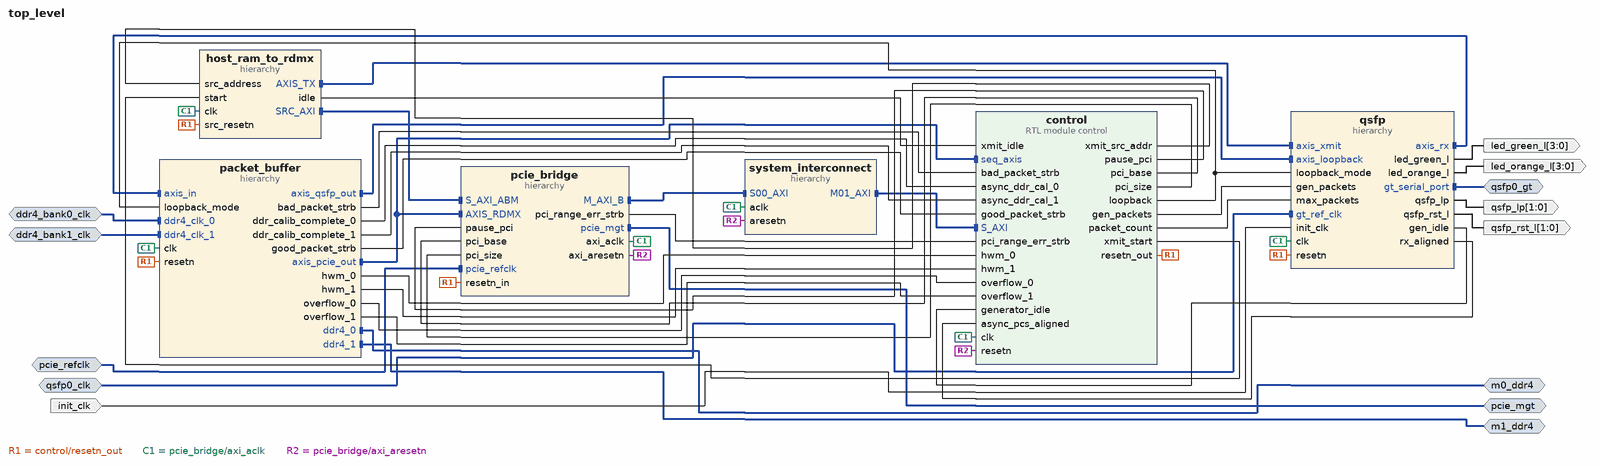
[diagram p0: block diagram of the top level]
# Vivado block design top_level, xcvu3p-ffvc1517-2-e, Vivado 2021.1
create_bd_design top_level

create_bd_intf_port -mode Slave -vlnv xilinx.com:interface:diff_clock_rtl:1.0 pcie_refclk
create_bd_intf_port -mode Master -vlnv xilinx.com:interface:pcie_7x_mgt_rtl:1.0 pcie_mgt
create_bd_intf_port -mode Slave -vlnv xilinx.com:interface:diff_clock_rtl:1.0 ddr4_bank0_clk
create_bd_intf_port -mode Master -vlnv xilinx.com:interface:ddr4_rtl:1.0 m0_ddr4
create_bd_intf_port -mode Master -vlnv xilinx.com:interface:ddr4_rtl:1.0 m1_ddr4
create_bd_intf_port -mode Slave -vlnv xilinx.com:interface:diff_clock_rtl:1.0 ddr4_bank1_clk
create_bd_intf_port -mode Slave -vlnv xilinx.com:interface:diff_clock_rtl:1.0 qsfp0_clk
set_property -dict {CONFIG.FREQ_HZ 322265625} [get_bd_intf_ports qsfp0_clk]
create_bd_intf_port -mode Master -vlnv xilinx.com:interface:gt_rtl:1.0 qsfp0_gt
create_bd_port -dir I init_clk
create_bd_port -dir O -from 1 -to 0 qsfp_lp
create_bd_port -dir O -from 1 -to 0 qsfp_rst_l
create_bd_port -dir O -from 3 -to 0 led_green_l
create_bd_port -dir O -from 3 -to 0 led_orange_l

create_bd_cell -type hier pcie_bridge
create_bd_cell -type hier packet_buffer
create_bd_cell -type hier qsfp
create_bd_cell -type hier system_interconnect
create_bd_cell -type hier host_ram_to_rdmx
create_bd_cell -type module -reference control control

# ---- hierarchy /pcie_bridge ----
current_bd_instance /pcie_bridge
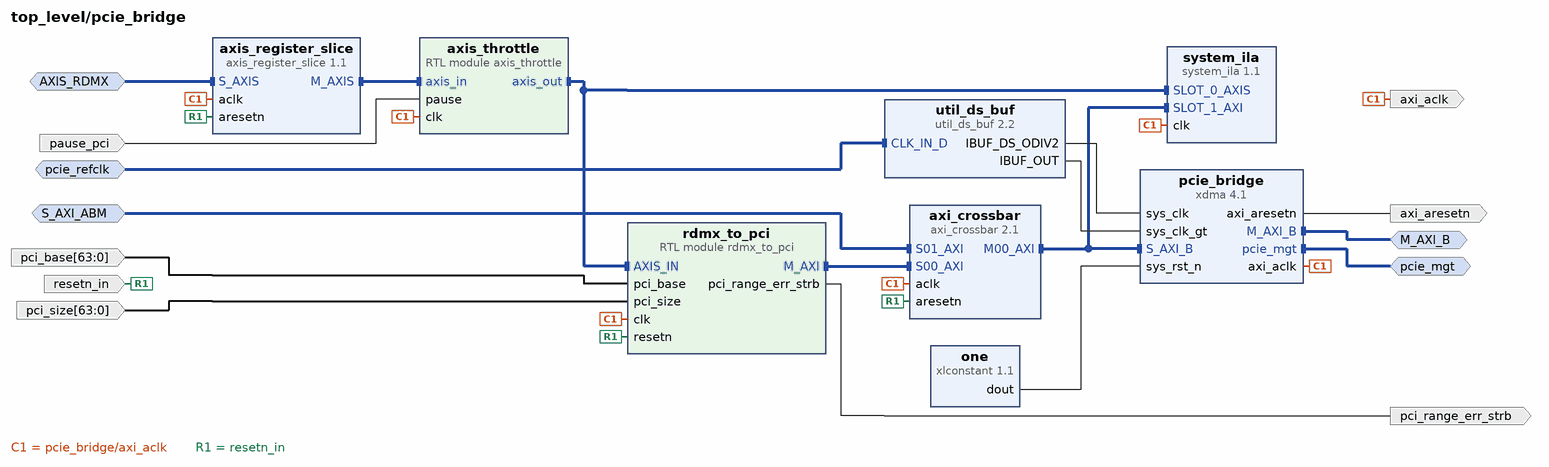
[diagram p1: block diagram inside /pcie_bridge]
create_bd_intf_pin -mode Master -vlnv xilinx.com:interface:pcie_7x_mgt_rtl:1.0 pcie_mgt
create_bd_intf_pin -mode Slave -vlnv xilinx.com:interface:diff_clock_rtl:1.0 pcie_refclk
create_bd_intf_pin -mode Master -vlnv xilinx.com:interface:aximm_rtl:1.0 M_AXI_B
create_bd_intf_pin -mode Slave -vlnv xilinx.com:interface:axis_rtl:1.0 AXIS_RDMX
create_bd_intf_pin -mode Slave -vlnv xilinx.com:interface:aximm_rtl:1.0 S_AXI_ABM
create_bd_pin -dir O axi_aclk
create_bd_pin -dir O axi_aresetn
create_bd_pin -dir I resetn_in
create_bd_pin -dir O pci_range_err_strb
create_bd_pin -dir I pause_pci
create_bd_pin -dir I -from 63 -to 0 pci_base
create_bd_pin -dir I -from 63 -to 0 pci_size

create_bd_cell -type ip -vlnv xilinx.com:ip:xdma:4.1 pcie_bridge
set_property -dict [list \
  CONFIG.PF0_DEVICE_ID_mqdma 903F \
  CONFIG.PF0_SRIOV_VF_DEVICE_ID A03F \
  CONFIG.PF2_DEVICE_ID_mqdma 923F \
  CONFIG.PF3_DEVICE_ID_mqdma 933F \
  CONFIG.axi_addr_width 64 \
  CONFIG.axi_data_width 512_bit \
  CONFIG.axisten_freq 250 \
  CONFIG.bridge_burst true \
  CONFIG.en_axi_slave_if true \
  CONFIG.functional_mode AXI_Bridge \
  CONFIG.mode_selection Advanced \
  CONFIG.pf0_bar0_scale Megabytes \
  CONFIG.pf0_bar0_size 1 \
  CONFIG.pf0_device_id 903F \
  CONFIG.pl_link_cap_max_link_speed 8.0_GT/s \
  CONFIG.pl_link_cap_max_link_width X16 \
  CONFIG.plltype QPLL1 \
] [get_bd_cells pcie_bridge]
create_bd_cell -type ip -vlnv xilinx.com:ip:util_ds_buf:2.2 util_ds_buf
set_property -dict {CONFIG.C_BUF_TYPE IBUFDSGTE} [get_bd_cells util_ds_buf]
create_bd_cell -type ip -vlnv xilinx.com:ip:system_ila:1.1 system_ila
set_property -dict [list \
  CONFIG.C_NUM_MONITOR_SLOTS 2 \
  CONFIG.C_SLOT_0_INTF_TYPE xilinx.com:interface:axis_rtl:1.0 \
] [get_bd_cells system_ila]
create_bd_cell -type ip -vlnv xilinx.com:ip:xlconstant:1.1 one
create_bd_cell -type ip -vlnv xilinx.com:ip:axis_register_slice:1.1 axis_register_slice
set_property -dict {CONFIG.REG_CONFIG 8} [get_bd_cells axis_register_slice]
create_bd_cell -type module -reference axis_throttle axis_throttle
create_bd_cell -type module -reference rdmx_to_pci rdmx_to_pci
create_bd_cell -type ip -vlnv xilinx.com:ip:axi_crossbar:2.1 axi_crossbar
set_property -dict [list \
  CONFIG.M00_S00_READ_CONNECTIVITY 0 \
  CONFIG.M00_S00_WRITE_CONNECTIVITY 1 \
  CONFIG.M00_S01_READ_CONNECTIVITY 1 \
  CONFIG.M00_S01_WRITE_CONNECTIVITY 0 \
  CONFIG.NUM_MI 1 \
  CONFIG.NUM_SI 2 \
] [get_bd_cells axi_crossbar]

# ---- hierarchy /packet_buffer ----
current_bd_instance /packet_buffer
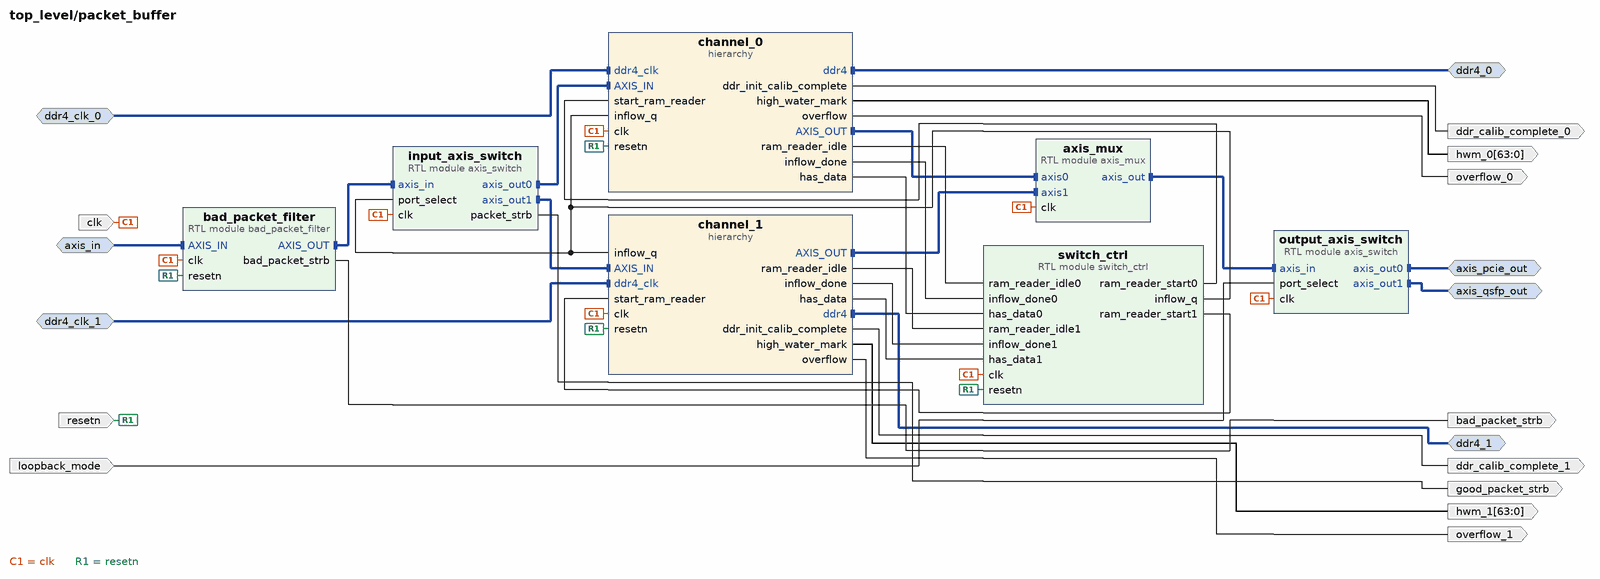
[diagram p2: block diagram inside /packet_buffer]
create_bd_intf_pin -mode Slave -vlnv xilinx.com:interface:axis_rtl:1.0 axis_in
create_bd_intf_pin -mode Master -vlnv xilinx.com:interface:ddr4_rtl:1.0 ddr4_0
create_bd_intf_pin -mode Slave -vlnv xilinx.com:interface:diff_clock_rtl:1.0 ddr4_clk_0
create_bd_intf_pin -mode Slave -vlnv xilinx.com:interface:diff_clock_rtl:1.0 ddr4_clk_1
create_bd_intf_pin -mode Master -vlnv xilinx.com:interface:ddr4_rtl:1.0 ddr4_1
create_bd_intf_pin -mode Master -vlnv xilinx.com:interface:axis_rtl:1.0 axis_pcie_out
create_bd_intf_pin -mode Master -vlnv xilinx.com:interface:axis_rtl:1.0 axis_qsfp_out
create_bd_pin -dir I -type clk clk
create_bd_pin -dir I resetn
create_bd_pin -dir O -from 63 -to 0 hwm_0
create_bd_pin -dir O -from 63 -to 0 hwm_1
create_bd_pin -dir I loopback_mode
create_bd_pin -dir O overflow_0
create_bd_pin -dir O overflow_1
create_bd_pin -dir O ddr_calib_complete_0
create_bd_pin -dir O ddr_calib_complete_1
create_bd_pin -dir O bad_packet_strb
create_bd_pin -dir O good_packet_strb

create_bd_cell -type hier channel_1
create_bd_cell -type hier channel_0
create_bd_cell -type module -reference switch_ctrl switch_ctrl
create_bd_cell -type module -reference axis_mux axis_mux
create_bd_cell -type module -reference axis_switch input_axis_switch
create_bd_cell -type module -reference axis_switch output_axis_switch
create_bd_cell -type module -reference bad_packet_filter bad_packet_filter

# ---- hierarchy /packet_buffer/channel_1 ----
current_bd_instance /packet_buffer/channel_1
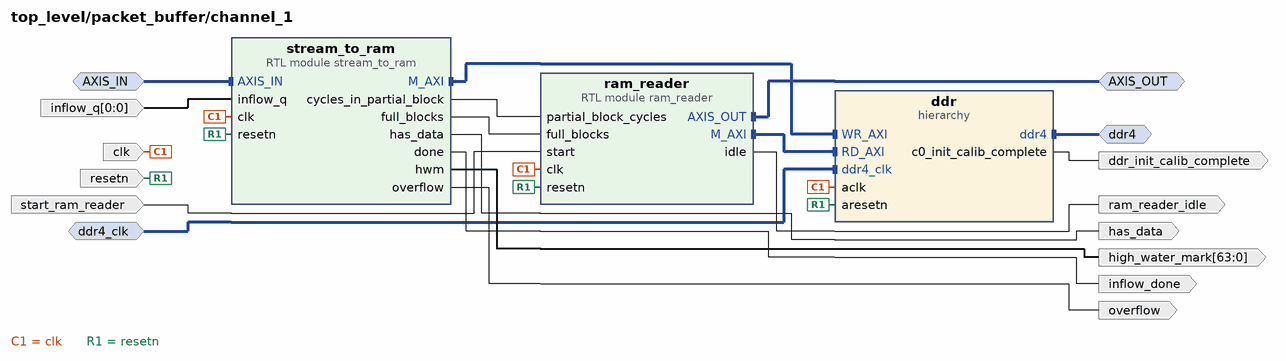
[diagram p3: block diagram inside /packet_buffer/channel_1]
create_bd_intf_pin -mode Slave -vlnv xilinx.com:interface:axis_rtl:1.0 AXIS_IN
create_bd_intf_pin -mode Master -vlnv xilinx.com:interface:axis_rtl:1.0 AXIS_OUT
create_bd_intf_pin -mode Master -vlnv xilinx.com:interface:ddr4_rtl:1.0 ddr4
create_bd_intf_pin -mode Slave -vlnv xilinx.com:interface:diff_clock_rtl:1.0 ddr4_clk
create_bd_pin -dir I -type clk clk
create_bd_pin -dir I resetn
create_bd_pin -dir I -from 0 -to 0 inflow_q
create_bd_pin -dir O ram_reader_idle
create_bd_pin -dir I start_ram_reader
create_bd_pin -dir O has_data
create_bd_pin -dir O inflow_done
create_bd_pin -dir O -from 63 -to 0 high_water_mark
create_bd_pin -dir O overflow
create_bd_pin -dir O ddr_init_calib_complete

create_bd_cell -type hier ddr
create_bd_cell -type module -reference ram_reader ram_reader
set_property -dict {CONFIG.CHANNEL 1} [get_bd_cells ram_reader]
create_bd_cell -type module -reference stream_to_ram stream_to_ram
set_property -dict {CONFIG.CHANNEL 1} [get_bd_cells stream_to_ram]

# ---- hierarchy /packet_buffer/channel_1/ddr ----
current_bd_instance /packet_buffer/channel_1/ddr
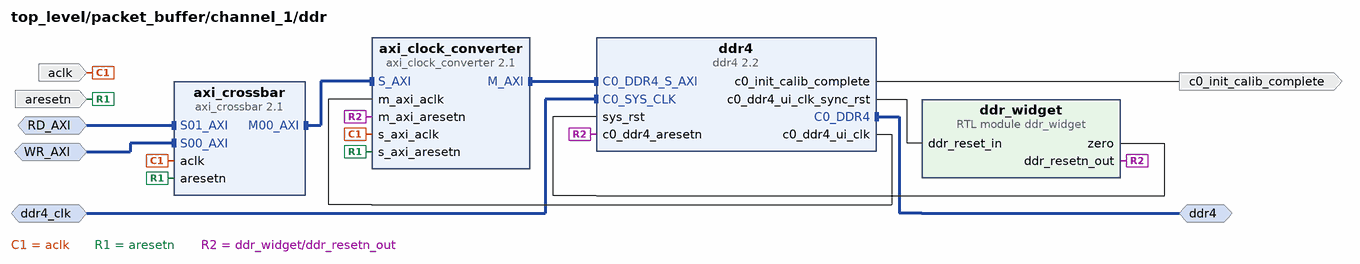
[diagram p4: block diagram inside /packet_buffer/channel_1/ddr]
create_bd_intf_pin -mode Slave -vlnv xilinx.com:interface:aximm_rtl:1.0 WR_AXI
create_bd_intf_pin -mode Slave -vlnv xilinx.com:interface:aximm_rtl:1.0 RD_AXI
create_bd_intf_pin -mode Slave -vlnv xilinx.com:interface:diff_clock_rtl:1.0 ddr4_clk
create_bd_intf_pin -mode Master -vlnv xilinx.com:interface:ddr4_rtl:1.0 ddr4
create_bd_pin -dir I aclk
create_bd_pin -dir I aresetn
create_bd_pin -dir O c0_init_calib_complete

create_bd_cell -type ip -vlnv xilinx.com:ip:axi_crossbar:2.1 axi_crossbar
set_property -dict [list \
  CONFIG.M00_S00_READ_CONNECTIVITY 0 \
  CONFIG.M00_S00_WRITE_CONNECTIVITY 1 \
  CONFIG.M00_S01_READ_CONNECTIVITY 1 \
  CONFIG.M00_S01_WRITE_CONNECTIVITY 0 \
  CONFIG.NUM_MI 1 \
  CONFIG.NUM_SI 2 \
  CONFIG.S00_SINGLE_THREAD 1 \
  CONFIG.S01_SINGLE_THREAD 1 \
] [get_bd_cells axi_crossbar]
create_bd_cell -type ip -vlnv xilinx.com:ip:axi_clock_converter:2.1 axi_clock_converter
create_bd_cell -type ip -vlnv xilinx.com:ip:ddr4:2.2 ddr4
set_property -dict [list \
  CONFIG.C0.DDR4_AxiAddressWidth 32 \
  CONFIG.C0.DDR4_AxiDataWidth 512 \
  CONFIG.C0.DDR4_DataWidth 64 \
  CONFIG.C0.DDR4_InputClockPeriod 10000 \
] [get_bd_cells ddr4]
create_bd_cell -type module -reference ddr_widget ddr_widget

# ---- hierarchy /packet_buffer/channel_0 ----
current_bd_instance /packet_buffer/channel_0
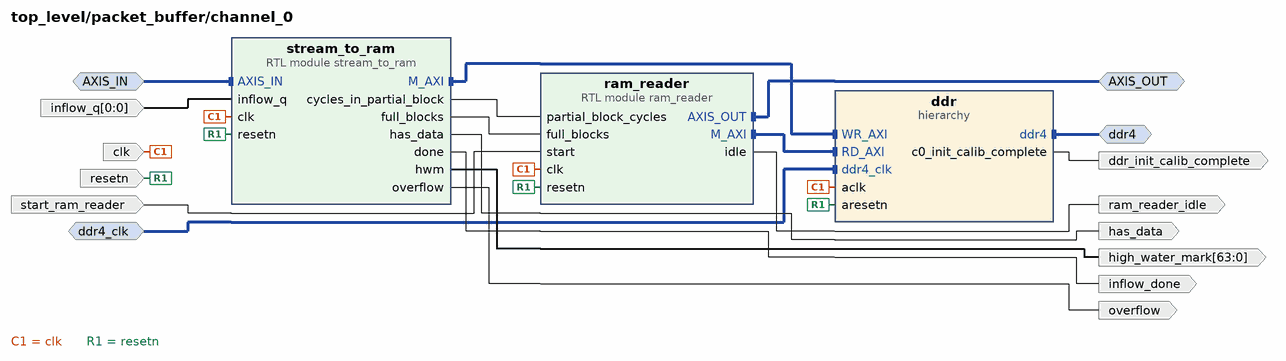
[diagram p5: block diagram inside /packet_buffer/channel_0]
create_bd_intf_pin -mode Slave -vlnv xilinx.com:interface:axis_rtl:1.0 AXIS_IN
create_bd_intf_pin -mode Master -vlnv xilinx.com:interface:axis_rtl:1.0 AXIS_OUT
create_bd_intf_pin -mode Master -vlnv xilinx.com:interface:ddr4_rtl:1.0 ddr4
create_bd_intf_pin -mode Slave -vlnv xilinx.com:interface:diff_clock_rtl:1.0 ddr4_clk
create_bd_pin -dir I -type clk clk
create_bd_pin -dir I resetn
create_bd_pin -dir I -from 0 -to 0 inflow_q
create_bd_pin -dir O ram_reader_idle
create_bd_pin -dir I start_ram_reader
create_bd_pin -dir O has_data
create_bd_pin -dir O inflow_done
create_bd_pin -dir O -from 63 -to 0 high_water_mark
create_bd_pin -dir O overflow
create_bd_pin -dir O ddr_init_calib_complete

create_bd_cell -type hier ddr
create_bd_cell -type module -reference ram_reader ram_reader
create_bd_cell -type module -reference stream_to_ram stream_to_ram

# ---- hierarchy /packet_buffer/channel_0/ddr ----
current_bd_instance /packet_buffer/channel_0/ddr
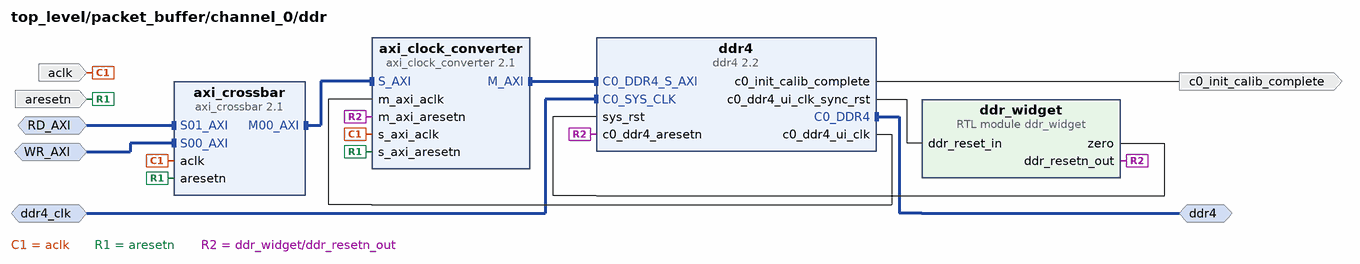
[diagram p6: block diagram inside /packet_buffer/channel_0/ddr]
create_bd_intf_pin -mode Slave -vlnv xilinx.com:interface:aximm_rtl:1.0 WR_AXI
create_bd_intf_pin -mode Slave -vlnv xilinx.com:interface:aximm_rtl:1.0 RD_AXI
create_bd_intf_pin -mode Slave -vlnv xilinx.com:interface:diff_clock_rtl:1.0 ddr4_clk
create_bd_intf_pin -mode Master -vlnv xilinx.com:interface:ddr4_rtl:1.0 ddr4
create_bd_pin -dir I aclk
create_bd_pin -dir I aresetn
create_bd_pin -dir O c0_init_calib_complete

create_bd_cell -type ip -vlnv xilinx.com:ip:axi_clock_converter:2.1 axi_clock_converter
create_bd_cell -type ip -vlnv xilinx.com:ip:ddr4:2.2 ddr4
set_property -dict [list \
  CONFIG.C0.DDR4_AxiAddressWidth 32 \
  CONFIG.C0.DDR4_AxiDataWidth 512 \
  CONFIG.C0.DDR4_DataWidth 64 \
  CONFIG.C0.DDR4_InputClockPeriod 10000 \
] [get_bd_cells ddr4]
create_bd_cell -type module -reference ddr_widget ddr_widget
create_bd_cell -type ip -vlnv xilinx.com:ip:axi_crossbar:2.1 axi_crossbar
set_property -dict [list \
  CONFIG.M00_S00_READ_CONNECTIVITY 0 \
  CONFIG.M00_S00_WRITE_CONNECTIVITY 1 \
  CONFIG.M00_S01_READ_CONNECTIVITY 1 \
  CONFIG.M00_S01_WRITE_CONNECTIVITY 0 \
  CONFIG.NUM_MI 1 \
  CONFIG.NUM_SI 2 \
  CONFIG.S00_SINGLE_THREAD 1 \
  CONFIG.S01_SINGLE_THREAD 1 \
] [get_bd_cells axi_crossbar]

# ---- hierarchy /qsfp ----
current_bd_instance /qsfp
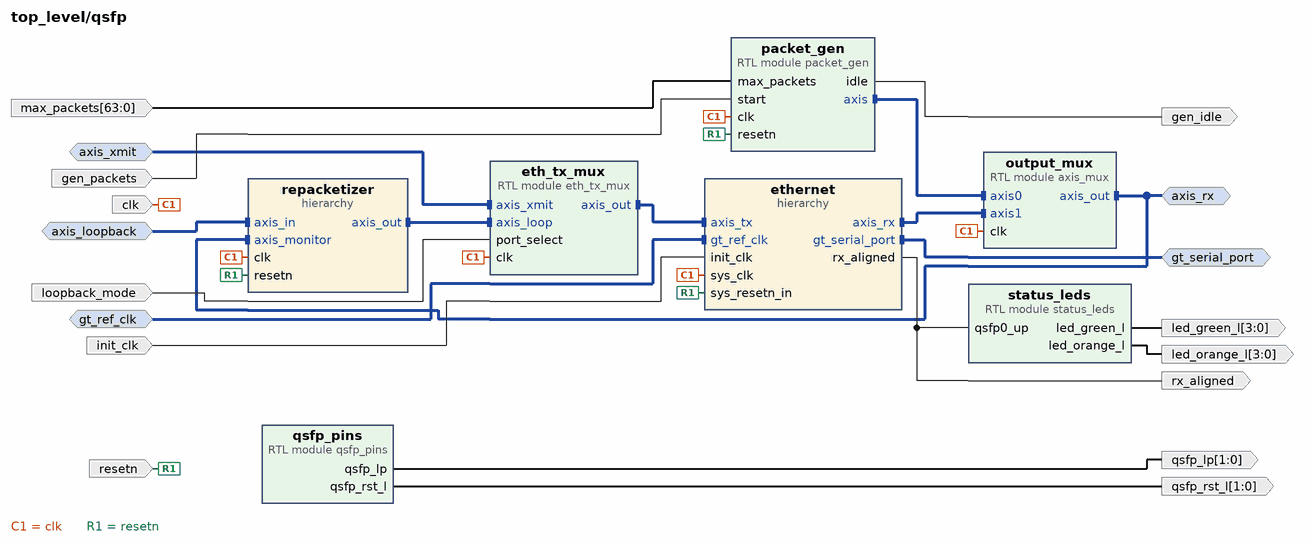
[diagram p7: block diagram inside /qsfp]
create_bd_intf_pin -mode Master -vlnv xilinx.com:interface:axis_rtl:1.0 axis_rx
create_bd_intf_pin -mode Slave -vlnv xilinx.com:interface:diff_clock_rtl:1.0 gt_ref_clk
create_bd_intf_pin -mode Master -vlnv xilinx.com:interface:gt_rtl:1.0 gt_serial_port
create_bd_intf_pin -mode Slave -vlnv xilinx.com:interface:axis_rtl:1.0 axis_loopback
create_bd_intf_pin -mode Slave -vlnv xilinx.com:interface:axis_rtl:1.0 axis_xmit
create_bd_pin -dir I -type clk clk
create_bd_pin -dir I -type rst resetn
create_bd_pin -dir I gen_packets
create_bd_pin -dir I -from 63 -to 0 max_packets
create_bd_pin -dir O gen_idle
create_bd_pin -dir I init_clk
create_bd_pin -dir O rx_aligned
create_bd_pin -dir O -from 1 -to 0 qsfp_rst_l
create_bd_pin -dir O -from 1 -to 0 qsfp_lp
create_bd_pin -dir O -from 3 -to 0 led_green_l
create_bd_pin -dir O -from 3 -to 0 led_orange_l
create_bd_pin -dir I loopback_mode

create_bd_cell -type hier ethernet
create_bd_cell -type module -reference qsfp_pins qsfp_pins
create_bd_cell -type module -reference status_leds status_leds
create_bd_cell -type module -reference axis_mux output_mux
create_bd_cell -type hier repacketizer
create_bd_cell -type module -reference packet_gen packet_gen
create_bd_cell -type module -reference eth_tx_mux eth_tx_mux

# ---- hierarchy /qsfp/ethernet ----
current_bd_instance /qsfp/ethernet
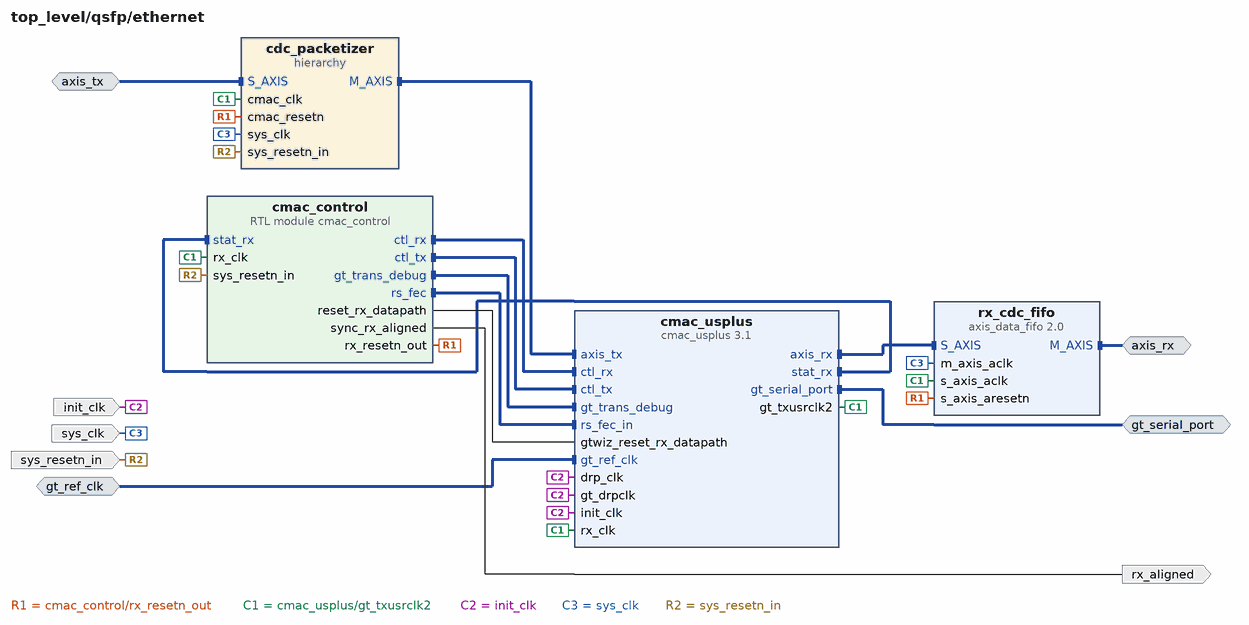
[diagram p8: block diagram inside /qsfp/ethernet]
create_bd_intf_pin -mode Master -vlnv xilinx.com:interface:gt_rtl:1.0 gt_serial_port
create_bd_intf_pin -mode Slave -vlnv xilinx.com:interface:diff_clock_rtl:1.0 gt_ref_clk
create_bd_intf_pin -mode Master -vlnv xilinx.com:interface:axis_rtl:1.0 axis_rx
create_bd_intf_pin -mode Slave -vlnv xilinx.com:interface:axis_rtl:1.0 axis_tx
create_bd_pin -dir O rx_aligned
create_bd_pin -dir I sys_resetn_in
create_bd_pin -dir I init_clk
create_bd_pin -dir I sys_clk

create_bd_cell -type ip -vlnv xilinx.com:ip:cmac_usplus:3.1 cmac_usplus
set_property -dict [list \
  CONFIG.ADD_GT_CNRL_STS_PORTS 1 \
  CONFIG.CMAC_CAUI4_MODE 1 \
  CONFIG.CMAC_CORE_SELECT CMACE4_X0Y2 \
  CONFIG.GT_GROUP_SELECT {X0Y16~X0Y19} \
  CONFIG.GT_REF_CLK_FREQ 322.265625 \
  CONFIG.INCLUDE_RS_FEC 1 \
  CONFIG.NUM_LANES 4x25 \
  CONFIG.RX_FLOW_CONTROL 0 \
  CONFIG.TX_FLOW_CONTROL 0 \
  CONFIG.USER_INTERFACE AXIS \
] [get_bd_cells cmac_usplus]
create_bd_cell -type module -reference cmac_control cmac_control
create_bd_cell -type ip -vlnv xilinx.com:ip:axis_data_fifo:2.0 rx_cdc_fifo
set_property -dict {CONFIG.FIFO_DEPTH 16 CONFIG.IS_ACLK_ASYNC 1} [get_bd_cells rx_cdc_fifo]
create_bd_cell -type hier cdc_packetizer

# ---- hierarchy /qsfp/ethernet/cdc_packetizer ----
current_bd_instance /qsfp/ethernet/cdc_packetizer
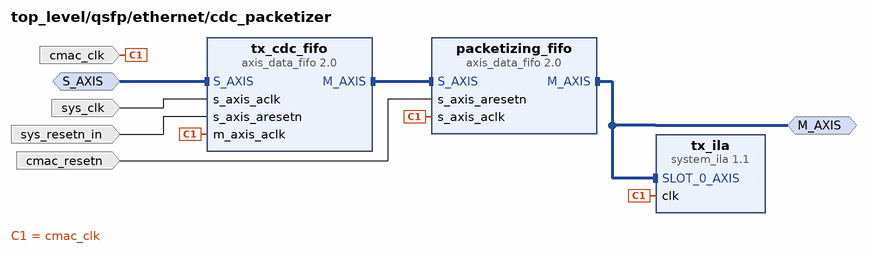
[diagram p9: block diagram inside /qsfp/ethernet/cdc_packetizer]
create_bd_intf_pin -mode Slave -vlnv xilinx.com:interface:axis_rtl:1.0 S_AXIS
create_bd_intf_pin -mode Master -vlnv xilinx.com:interface:axis_rtl:1.0 M_AXIS
create_bd_pin -dir I sys_resetn_in
create_bd_pin -dir I sys_clk
create_bd_pin -dir I -type clk cmac_clk
create_bd_pin -dir I -type rst cmac_resetn

create_bd_cell -type ip -vlnv xilinx.com:ip:axis_data_fifo:2.0 tx_cdc_fifo
set_property -dict {CONFIG.FIFO_DEPTH 16 CONFIG.IS_ACLK_ASYNC 1} [get_bd_cells tx_cdc_fifo]
create_bd_cell -type ip -vlnv xilinx.com:ip:axis_data_fifo:2.0 packetizing_fifo
set_property -dict {CONFIG.FIFO_DEPTH 256 CONFIG.FIFO_MODE 2 CONFIG.IS_ACLK_ASYNC 0} [get_bd_cells packetizing_fifo]
create_bd_cell -type ip -vlnv xilinx.com:ip:system_ila:1.1 tx_ila
set_property -dict {CONFIG.C_SLOT_0_INTF_TYPE xilinx.com:interface:axis_rtl:1.0} [get_bd_cells tx_ila]

# ---- hierarchy /qsfp/repacketizer ----
current_bd_instance /qsfp/repacketizer
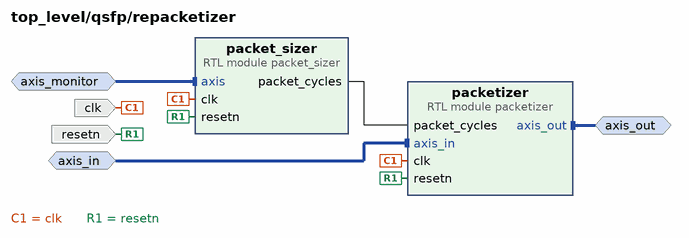
[diagram p10: block diagram inside /qsfp/repacketizer]
create_bd_intf_pin -mode Monitor -vlnv xilinx.com:interface:axis_rtl:1.0 axis_monitor
create_bd_intf_pin -mode Slave -vlnv xilinx.com:interface:axis_rtl:1.0 axis_in
create_bd_intf_pin -mode Master -vlnv xilinx.com:interface:axis_rtl:1.0 axis_out
create_bd_pin -dir I -type clk clk
create_bd_pin -dir I -type rst resetn

create_bd_cell -type module -reference packet_sizer packet_sizer
create_bd_cell -type module -reference packetizer packetizer

# ---- hierarchy /system_interconnect ----
current_bd_instance /system_interconnect
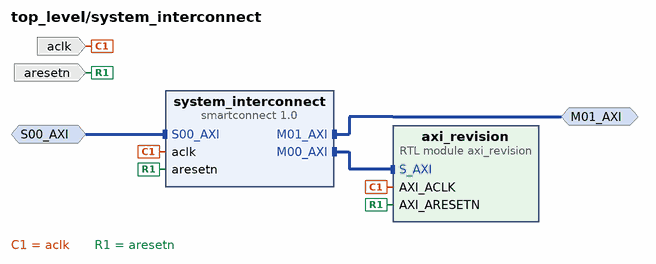
[diagram p11: block diagram inside /system_interconnect]
create_bd_intf_pin -mode Slave -vlnv xilinx.com:interface:aximm_rtl:1.0 S00_AXI
create_bd_intf_pin -mode Master -vlnv xilinx.com:interface:aximm_rtl:1.0 M01_AXI
create_bd_pin -dir I -type clk aclk
create_bd_pin -dir I -type rst aresetn

create_bd_cell -type module -reference axi_revision axi_revision
create_bd_cell -type ip -vlnv xilinx.com:ip:smartconnect:1.0 system_interconnect
set_property -dict {CONFIG.NUM_MI 2 CONFIG.NUM_SI 1} [get_bd_cells system_interconnect]

# ---- hierarchy /host_ram_to_rdmx ----
current_bd_instance /host_ram_to_rdmx
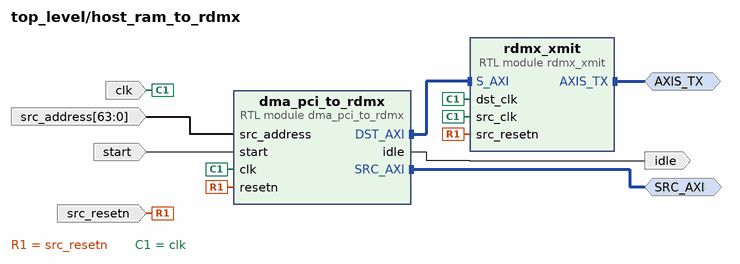
[diagram p12: block diagram inside /host_ram_to_rdmx]
create_bd_intf_pin -mode Master -vlnv xilinx.com:interface:aximm_rtl:1.0 SRC_AXI
create_bd_intf_pin -mode Master -vlnv xilinx.com:interface:axis_rtl:1.0 AXIS_TX
create_bd_pin -dir I -type clk clk
create_bd_pin -dir I -type rst src_resetn
create_bd_pin -dir I -from 63 -to 0 src_address
create_bd_pin -dir I start
create_bd_pin -dir O idle

create_bd_cell -type module -reference dma_pci_to_rdmx dma_pci_to_rdmx
create_bd_cell -type module -reference rdmx_xmit rdmx_xmit
set_property -dict {CONFIG.FIFO_CLOCK_MODE common_clock} [get_bd_cells rdmx_xmit]

# ---- connections ----

current_bd_instance /pcie_bridge
connect_bd_intf_net [get_bd_intf_pins axis_throttle/axis_out] [get_bd_intf_pins rdmx_to_pci/AXIS_IN]
connect_bd_intf_net [get_bd_intf_pins axis_throttle/axis_out] [get_bd_intf_pins system_ila/SLOT_0_AXIS]
connect_bd_intf_net [get_bd_intf_pins AXIS_RDMX] [get_bd_intf_pins axis_register_slice/S_AXIS]
connect_bd_intf_net [get_bd_intf_pins pcie_refclk] [get_bd_intf_pins util_ds_buf/CLK_IN_D]
connect_bd_intf_net [get_bd_intf_pins S_AXI_ABM] [get_bd_intf_pins axi_crossbar/S01_AXI]
connect_bd_intf_net [get_bd_intf_pins axi_crossbar/M00_AXI] [get_bd_intf_pins pcie_bridge/S_AXI_B]
connect_bd_intf_net [get_bd_intf_pins axi_crossbar/M00_AXI] [get_bd_intf_pins system_ila/SLOT_1_AXI]
connect_bd_intf_net [get_bd_intf_pins axis_register_slice/M_AXIS] [get_bd_intf_pins axis_throttle/axis_in]
connect_bd_intf_net [get_bd_intf_pins M_AXI_B] [get_bd_intf_pins pcie_bridge/M_AXI_B]
connect_bd_intf_net [get_bd_intf_pins pcie_mgt] [get_bd_intf_pins pcie_bridge/pcie_mgt]
connect_bd_intf_net [get_bd_intf_pins axi_crossbar/S00_AXI] [get_bd_intf_pins rdmx_to_pci/M_AXI]
connect_bd_net [get_bd_pins one/dout] [get_bd_pins pcie_bridge/sys_rst_n]
connect_bd_net -net pause_1 [get_bd_pins pause_pci] [get_bd_pins axis_throttle/pause]
connect_bd_net [get_bd_pins pci_base] [get_bd_pins rdmx_to_pci/pci_base]
connect_bd_net [get_bd_pins pci_size] [get_bd_pins rdmx_to_pci/pci_size]
connect_bd_net [get_bd_pins pcie_bridge/axi_aclk] \
  [get_bd_pins axi_aclk] [get_bd_pins system_ila/clk] [get_bd_pins axis_register_slice/aclk] [get_bd_pins axis_throttle/clk] \
  [get_bd_pins rdmx_to_pci/clk] [get_bd_pins axi_crossbar/aclk]
connect_bd_net [get_bd_pins pcie_bridge/axi_aresetn] [get_bd_pins axi_aresetn]
connect_bd_net -net rdmx_to_pci_pci_range_err [get_bd_pins rdmx_to_pci/pci_range_err_strb] [get_bd_pins pci_range_err_strb]
connect_bd_net [get_bd_pins resetn_in] [get_bd_pins axis_register_slice/aresetn] [get_bd_pins rdmx_to_pci/resetn] [get_bd_pins axi_crossbar/aresetn]
connect_bd_net -net util_ds_buf_0_IBUF_DS_ODIV2 [get_bd_pins util_ds_buf/IBUF_DS_ODIV2] [get_bd_pins pcie_bridge/sys_clk]
connect_bd_net -net util_ds_buf_0_IBUF_OUT [get_bd_pins util_ds_buf/IBUF_OUT] [get_bd_pins pcie_bridge/sys_clk_gt]

current_bd_instance /packet_buffer
connect_bd_intf_net [get_bd_intf_pins axis_pcie_out] [get_bd_intf_pins output_axis_switch/axis_out0]
connect_bd_intf_net [get_bd_intf_pins axis_in] [get_bd_intf_pins bad_packet_filter/AXIS_IN]
connect_bd_intf_net [get_bd_intf_pins axis_mux/axis_out] [get_bd_intf_pins output_axis_switch/axis_in]
connect_bd_intf_net [get_bd_intf_pins channel_0/AXIS_IN] [get_bd_intf_pins input_axis_switch/axis_out0]
connect_bd_intf_net [get_bd_intf_pins channel_1/AXIS_IN] [get_bd_intf_pins input_axis_switch/axis_out1]
connect_bd_intf_net [get_bd_intf_pins input_axis_switch/axis_in] [get_bd_intf_pins bad_packet_filter/AXIS_OUT]
connect_bd_intf_net [get_bd_intf_pins axis_mux/axis0] [get_bd_intf_pins channel_0/AXIS_OUT]
connect_bd_intf_net [get_bd_intf_pins ddr4_0] [get_bd_intf_pins channel_0/ddr4]
connect_bd_intf_net [get_bd_intf_pins axis_mux/axis1] [get_bd_intf_pins channel_1/AXIS_OUT]
connect_bd_intf_net [get_bd_intf_pins ddr4_1] [get_bd_intf_pins channel_1/ddr4]
connect_bd_intf_net [get_bd_intf_pins ddr4_clk_0] [get_bd_intf_pins channel_0/ddr4_clk]
connect_bd_intf_net [get_bd_intf_pins ddr4_clk_1] [get_bd_intf_pins channel_1/ddr4_clk]
connect_bd_intf_net [get_bd_intf_pins axis_qsfp_out] [get_bd_intf_pins output_axis_switch/axis_out1]
connect_bd_net [get_bd_pins bad_packet_filter/bad_packet_strb] [get_bd_pins bad_packet_strb]
connect_bd_net [get_bd_pins channel_0/ddr_init_calib_complete] [get_bd_pins ddr_calib_complete_0]
connect_bd_net [get_bd_pins channel_0/high_water_mark] [get_bd_pins hwm_0]
connect_bd_net [get_bd_pins channel_0/overflow] [get_bd_pins overflow_0]
connect_bd_net [get_bd_pins channel_0/ram_reader_idle] [get_bd_pins switch_ctrl/ram_reader_idle0]
connect_bd_net [get_bd_pins channel_1/ddr_init_calib_complete] [get_bd_pins ddr_calib_complete_1]
connect_bd_net [get_bd_pins channel_1/high_water_mark] [get_bd_pins hwm_1]
connect_bd_net [get_bd_pins channel_1/overflow] [get_bd_pins overflow_1]
connect_bd_net [get_bd_pins channel_1/ram_reader_idle] [get_bd_pins switch_ctrl/ram_reader_idle1]
connect_bd_net [get_bd_pins input_axis_switch/packet_strb] [get_bd_pins good_packet_strb]
connect_bd_net -net pcie_bridge_axi_aclk [get_bd_pins clk] \
  [get_bd_pins channel_1/clk] [get_bd_pins channel_0/clk] [get_bd_pins switch_ctrl/clk] [get_bd_pins axis_mux/clk] \
  [get_bd_pins input_axis_switch/clk] [get_bd_pins output_axis_switch/clk] [get_bd_pins bad_packet_filter/clk]
connect_bd_net -net port_select_1 [get_bd_pins loopback_mode] [get_bd_pins output_axis_switch/port_select]
connect_bd_net [get_bd_pins resetn] \
  [get_bd_pins channel_1/resetn] [get_bd_pins channel_0/resetn] [get_bd_pins switch_ctrl/resetn] \
  [get_bd_pins bad_packet_filter/resetn]
connect_bd_net -net start_ram_reader_0 [get_bd_pins switch_ctrl/ram_reader_start0] [get_bd_pins channel_0/start_ram_reader]
connect_bd_net -net start_ram_reader_1 [get_bd_pins switch_ctrl/ram_reader_start1] [get_bd_pins channel_1/start_ram_reader]
connect_bd_net -net stream_to_ram_0_done [get_bd_pins channel_0/inflow_done] [get_bd_pins switch_ctrl/inflow_done0]
connect_bd_net -net stream_to_ram_0_has_data [get_bd_pins channel_0/has_data] [get_bd_pins switch_ctrl/has_data0]
connect_bd_net -net stream_to_ram_1_done [get_bd_pins channel_1/inflow_done] [get_bd_pins switch_ctrl/inflow_done1]
connect_bd_net -net stream_to_ram_1_has_data [get_bd_pins channel_1/has_data] [get_bd_pins switch_ctrl/has_data1]
connect_bd_net -net switch_ctrl_0_inflow_q [get_bd_pins switch_ctrl/inflow_q] \
  [get_bd_pins channel_1/inflow_q] [get_bd_pins channel_0/inflow_q] [get_bd_pins input_axis_switch/port_select]

current_bd_instance /packet_buffer/channel_1
connect_bd_intf_net [get_bd_intf_pins AXIS_IN] [get_bd_intf_pins stream_to_ram/AXIS_IN]
connect_bd_intf_net [get_bd_intf_pins ddr4_clk] [get_bd_intf_pins ddr/ddr4_clk]
connect_bd_intf_net [get_bd_intf_pins ddr4] [get_bd_intf_pins ddr/ddr4]
connect_bd_intf_net [get_bd_intf_pins AXIS_OUT] [get_bd_intf_pins ram_reader/AXIS_OUT]
connect_bd_intf_net [get_bd_intf_pins ram_reader/M_AXI] [get_bd_intf_pins ddr/RD_AXI]
connect_bd_intf_net [get_bd_intf_pins stream_to_ram/M_AXI] [get_bd_intf_pins ddr/WR_AXI]
connect_bd_net [get_bd_pins ddr/c0_init_calib_complete] [get_bd_pins ddr_init_calib_complete]
connect_bd_net -net pcie_bridge_axi_aclk [get_bd_pins clk] [get_bd_pins ddr/aclk] [get_bd_pins ram_reader/clk] [get_bd_pins stream_to_ram/clk]
connect_bd_net -net ram_reader_0_idle [get_bd_pins ram_reader/idle] [get_bd_pins ram_reader_idle]
connect_bd_net [get_bd_pins resetn] [get_bd_pins ddr/aresetn] [get_bd_pins ram_reader/resetn] [get_bd_pins stream_to_ram/resetn]
connect_bd_net [get_bd_pins start_ram_reader] [get_bd_pins ram_reader/start]
connect_bd_net [get_bd_pins stream_to_ram/cycles_in_partial_block] [get_bd_pins ram_reader/partial_block_cycles]
connect_bd_net [get_bd_pins stream_to_ram/done] [get_bd_pins inflow_done]
connect_bd_net [get_bd_pins stream_to_ram/full_blocks] [get_bd_pins ram_reader/full_blocks]
connect_bd_net [get_bd_pins stream_to_ram/has_data] [get_bd_pins has_data]
connect_bd_net [get_bd_pins stream_to_ram/hwm] [get_bd_pins high_water_mark]
connect_bd_net [get_bd_pins stream_to_ram/overflow] [get_bd_pins overflow]
connect_bd_net -net switch_ctrl_0_inflow_q [get_bd_pins inflow_q] [get_bd_pins stream_to_ram/inflow_q]

current_bd_instance /packet_buffer/channel_1/ddr
connect_bd_intf_net [get_bd_intf_pins RD_AXI] [get_bd_intf_pins axi_crossbar/S01_AXI]
connect_bd_intf_net [get_bd_intf_pins WR_AXI] [get_bd_intf_pins axi_crossbar/S00_AXI]
connect_bd_intf_net [get_bd_intf_pins axi_clock_converter/M_AXI] [get_bd_intf_pins ddr4/C0_DDR4_S_AXI]
connect_bd_intf_net [get_bd_intf_pins axi_crossbar/M00_AXI] [get_bd_intf_pins axi_clock_converter/S_AXI]
connect_bd_intf_net [get_bd_intf_pins ddr4] [get_bd_intf_pins ddr4/C0_DDR4]
connect_bd_intf_net [get_bd_intf_pins ddr4_clk] [get_bd_intf_pins ddr4/C0_SYS_CLK]
connect_bd_net [get_bd_pins aclk] [get_bd_pins axi_crossbar/aclk] [get_bd_pins axi_clock_converter/s_axi_aclk]
connect_bd_net [get_bd_pins aresetn] [get_bd_pins axi_crossbar/aresetn] [get_bd_pins axi_clock_converter/s_axi_aresetn]
connect_bd_net [get_bd_pins ddr4/c0_ddr4_ui_clk] [get_bd_pins axi_clock_converter/m_axi_aclk]
connect_bd_net [get_bd_pins ddr4/c0_ddr4_ui_clk_sync_rst] [get_bd_pins ddr_widget/ddr_reset_in]
connect_bd_net [get_bd_pins ddr4/c0_init_calib_complete] [get_bd_pins c0_init_calib_complete]
connect_bd_net -net ddr_widget_0_ddr_resetn_out [get_bd_pins ddr_widget/ddr_resetn_out] \
  [get_bd_pins axi_clock_converter/m_axi_aresetn] [get_bd_pins ddr4/c0_ddr4_aresetn]
connect_bd_net -net ddr_widget_0_zero [get_bd_pins ddr_widget/zero] [get_bd_pins ddr4/sys_rst]

current_bd_instance /packet_buffer/channel_0
connect_bd_intf_net [get_bd_intf_pins AXIS_IN] [get_bd_intf_pins stream_to_ram/AXIS_IN]
connect_bd_intf_net [get_bd_intf_pins ddr4_clk] [get_bd_intf_pins ddr/ddr4_clk]
connect_bd_intf_net [get_bd_intf_pins ddr4] [get_bd_intf_pins ddr/ddr4]
connect_bd_intf_net [get_bd_intf_pins AXIS_OUT] [get_bd_intf_pins ram_reader/AXIS_OUT]
connect_bd_intf_net [get_bd_intf_pins ram_reader/M_AXI] [get_bd_intf_pins ddr/RD_AXI]
connect_bd_intf_net [get_bd_intf_pins stream_to_ram/M_AXI] [get_bd_intf_pins ddr/WR_AXI]
connect_bd_net [get_bd_pins ddr/c0_init_calib_complete] [get_bd_pins ddr_init_calib_complete]
connect_bd_net -net pcie_bridge_axi_aclk [get_bd_pins clk] [get_bd_pins ddr/aclk] [get_bd_pins ram_reader/clk] [get_bd_pins stream_to_ram/clk]
connect_bd_net [get_bd_pins ram_reader/idle] [get_bd_pins ram_reader_idle]
connect_bd_net [get_bd_pins resetn] [get_bd_pins ddr/aresetn] [get_bd_pins ram_reader/resetn] [get_bd_pins stream_to_ram/resetn]
connect_bd_net [get_bd_pins start_ram_reader] [get_bd_pins ram_reader/start]
connect_bd_net [get_bd_pins stream_to_ram/cycles_in_partial_block] [get_bd_pins ram_reader/partial_block_cycles]
connect_bd_net [get_bd_pins stream_to_ram/done] [get_bd_pins inflow_done]
connect_bd_net [get_bd_pins stream_to_ram/full_blocks] [get_bd_pins ram_reader/full_blocks]
connect_bd_net [get_bd_pins stream_to_ram/has_data] [get_bd_pins has_data]
connect_bd_net [get_bd_pins stream_to_ram/hwm] [get_bd_pins high_water_mark]
connect_bd_net [get_bd_pins stream_to_ram/overflow] [get_bd_pins overflow]
connect_bd_net -net switch_ctrl_0_inflow_q [get_bd_pins inflow_q] [get_bd_pins stream_to_ram/inflow_q]

current_bd_instance /packet_buffer/channel_0/ddr
connect_bd_intf_net [get_bd_intf_pins RD_AXI] [get_bd_intf_pins axi_crossbar/S01_AXI]
connect_bd_intf_net [get_bd_intf_pins WR_AXI] [get_bd_intf_pins axi_crossbar/S00_AXI]
connect_bd_intf_net [get_bd_intf_pins axi_clock_converter/M_AXI] [get_bd_intf_pins ddr4/C0_DDR4_S_AXI]
connect_bd_intf_net [get_bd_intf_pins axi_crossbar/M00_AXI] [get_bd_intf_pins axi_clock_converter/S_AXI]
connect_bd_intf_net [get_bd_intf_pins ddr4] [get_bd_intf_pins ddr4/C0_DDR4]
connect_bd_intf_net [get_bd_intf_pins ddr4_clk] [get_bd_intf_pins ddr4/C0_SYS_CLK]
connect_bd_net [get_bd_pins aclk] [get_bd_pins axi_clock_converter/s_axi_aclk] [get_bd_pins axi_crossbar/aclk]
connect_bd_net [get_bd_pins aresetn] [get_bd_pins axi_clock_converter/s_axi_aresetn] [get_bd_pins axi_crossbar/aresetn]
connect_bd_net [get_bd_pins ddr4/c0_ddr4_ui_clk] [get_bd_pins axi_clock_converter/m_axi_aclk]
connect_bd_net [get_bd_pins ddr4/c0_ddr4_ui_clk_sync_rst] [get_bd_pins ddr_widget/ddr_reset_in]
connect_bd_net [get_bd_pins ddr4/c0_init_calib_complete] [get_bd_pins c0_init_calib_complete]
connect_bd_net -net ddr_widget_0_ddr_resetn_out [get_bd_pins ddr_widget/ddr_resetn_out] \
  [get_bd_pins axi_clock_converter/m_axi_aresetn] [get_bd_pins ddr4/c0_ddr4_aresetn]
connect_bd_net -net ddr_widget_0_zero [get_bd_pins ddr_widget/zero] [get_bd_pins ddr4/sys_rst]

current_bd_instance /qsfp
connect_bd_intf_net [get_bd_intf_pins gt_ref_clk] [get_bd_intf_pins ethernet/gt_ref_clk]
connect_bd_intf_net [get_bd_intf_pins gt_serial_port] [get_bd_intf_pins ethernet/gt_serial_port]
connect_bd_intf_net [get_bd_intf_pins axis_rx] [get_bd_intf_pins output_mux/axis_out]
connect_bd_intf_net [get_bd_intf_pins axis_rx] [get_bd_intf_pins repacketizer/axis_monitor]
connect_bd_intf_net [get_bd_intf_pins axis_loopback] [get_bd_intf_pins repacketizer/axis_in]
connect_bd_intf_net [get_bd_intf_pins eth_tx_mux/axis_out] [get_bd_intf_pins ethernet/axis_tx]
connect_bd_intf_net [get_bd_intf_pins ethernet/axis_rx] [get_bd_intf_pins output_mux/axis1]
connect_bd_intf_net [get_bd_intf_pins packet_gen/axis] [get_bd_intf_pins output_mux/axis0]
connect_bd_intf_net [get_bd_intf_pins repacketizer/axis_out] [get_bd_intf_pins eth_tx_mux/axis_loop]
connect_bd_intf_net [get_bd_intf_pins axis_xmit] [get_bd_intf_pins eth_tx_mux/axis_xmit]
connect_bd_net [get_bd_pins ethernet/rx_aligned] [get_bd_pins rx_aligned] [get_bd_pins status_leds/qsfp0_up]
connect_bd_net [get_bd_pins init_clk] [get_bd_pins ethernet/init_clk]
connect_bd_net [get_bd_pins max_packets] [get_bd_pins packet_gen/max_packets]
connect_bd_net [get_bd_pins packet_gen/idle] [get_bd_pins gen_idle]
connect_bd_net -net pcie_bridge_axi_aclk [get_bd_pins clk] \
  [get_bd_pins ethernet/sys_clk] [get_bd_pins output_mux/clk] [get_bd_pins repacketizer/clk] [get_bd_pins packet_gen/clk] \
  [get_bd_pins eth_tx_mux/clk]
connect_bd_net -net pcie_bridge_axi_aresetn [get_bd_pins resetn] \
  [get_bd_pins ethernet/sys_resetn_in] [get_bd_pins repacketizer/resetn] [get_bd_pins packet_gen/resetn]
connect_bd_net -net port_select_1 [get_bd_pins loopback_mode] [get_bd_pins eth_tx_mux/port_select]
connect_bd_net -net qsfp_pins_0_qsfp_lp [get_bd_pins qsfp_pins/qsfp_lp] [get_bd_pins qsfp_lp]
connect_bd_net -net qsfp_pins_0_qsfp_rst_l [get_bd_pins qsfp_pins/qsfp_rst_l] [get_bd_pins qsfp_rst_l]
connect_bd_net -net start_1 [get_bd_pins gen_packets] [get_bd_pins packet_gen/start]
connect_bd_net [get_bd_pins status_leds/led_green_l] [get_bd_pins led_green_l]
connect_bd_net [get_bd_pins status_leds/led_orange_l] [get_bd_pins led_orange_l]

current_bd_instance /qsfp/ethernet
connect_bd_intf_net [get_bd_intf_pins axis_tx] [get_bd_intf_pins cdc_packetizer/S_AXIS]
connect_bd_intf_net [get_bd_intf_pins axis_rx] [get_bd_intf_pins rx_cdc_fifo/M_AXIS]
connect_bd_intf_net [get_bd_intf_pins cmac_control/ctl_rx] [get_bd_intf_pins cmac_usplus/ctl_rx]
connect_bd_intf_net [get_bd_intf_pins cmac_control/ctl_tx] [get_bd_intf_pins cmac_usplus/ctl_tx]
connect_bd_intf_net [get_bd_intf_pins cmac_control/gt_trans_debug] [get_bd_intf_pins cmac_usplus/gt_trans_debug]
connect_bd_intf_net [get_bd_intf_pins cmac_control/rs_fec] [get_bd_intf_pins cmac_usplus/rs_fec_in]
connect_bd_intf_net [get_bd_intf_pins rx_cdc_fifo/S_AXIS] [get_bd_intf_pins cmac_usplus/axis_rx]
connect_bd_intf_net [get_bd_intf_pins gt_serial_port] [get_bd_intf_pins cmac_usplus/gt_serial_port]
connect_bd_intf_net [get_bd_intf_pins cmac_usplus/stat_rx] [get_bd_intf_pins cmac_control/stat_rx]
connect_bd_intf_net [get_bd_intf_pins gt_ref_clk] [get_bd_intf_pins cmac_usplus/gt_ref_clk]
connect_bd_intf_net [get_bd_intf_pins cdc_packetizer/M_AXIS] [get_bd_intf_pins cmac_usplus/axis_tx]
connect_bd_net [get_bd_pins cmac_control/reset_rx_datapath] [get_bd_pins cmac_usplus/gtwiz_reset_rx_datapath]
connect_bd_net [get_bd_pins cmac_control/rx_resetn_out] [get_bd_pins rx_cdc_fifo/s_axis_aresetn] [get_bd_pins cdc_packetizer/cmac_resetn]
connect_bd_net [get_bd_pins cmac_control/sync_rx_aligned] [get_bd_pins rx_aligned]
connect_bd_net [get_bd_pins cmac_usplus/gt_txusrclk2] \
  [get_bd_pins cmac_usplus/rx_clk] [get_bd_pins cmac_control/rx_clk] [get_bd_pins rx_cdc_fifo/s_axis_aclk] \
  [get_bd_pins cdc_packetizer/cmac_clk]
connect_bd_net [get_bd_pins init_clk] [get_bd_pins cmac_usplus/init_clk] [get_bd_pins cmac_usplus/drp_clk] [get_bd_pins cmac_usplus/gt_drpclk]
connect_bd_net [get_bd_pins sys_clk] [get_bd_pins rx_cdc_fifo/m_axis_aclk] [get_bd_pins cdc_packetizer/sys_clk]
connect_bd_net [get_bd_pins sys_resetn_in] [get_bd_pins cmac_control/sys_resetn_in] [get_bd_pins cdc_packetizer/sys_resetn_in]

current_bd_instance /qsfp/ethernet/cdc_packetizer
connect_bd_intf_net [get_bd_intf_pins S_AXIS] [get_bd_intf_pins tx_cdc_fifo/S_AXIS]
connect_bd_intf_net [get_bd_intf_pins M_AXIS] [get_bd_intf_pins packetizing_fifo/M_AXIS]
connect_bd_intf_net [get_bd_intf_pins M_AXIS] [get_bd_intf_pins tx_ila/SLOT_0_AXIS]
connect_bd_intf_net [get_bd_intf_pins tx_cdc_fifo/M_AXIS] [get_bd_intf_pins packetizing_fifo/S_AXIS]
connect_bd_net -net cmac_control_rx_resetn_out [get_bd_pins cmac_resetn] [get_bd_pins packetizing_fifo/s_axis_aresetn]
connect_bd_net -net cmac_usplus_gt_txusrclk2 [get_bd_pins cmac_clk] \
  [get_bd_pins packetizing_fifo/s_axis_aclk] [get_bd_pins tx_cdc_fifo/m_axis_aclk] [get_bd_pins tx_ila/clk]
connect_bd_net [get_bd_pins sys_clk] [get_bd_pins tx_cdc_fifo/s_axis_aclk]
connect_bd_net [get_bd_pins sys_resetn_in] [get_bd_pins tx_cdc_fifo/s_axis_aresetn]

current_bd_instance /qsfp/repacketizer
connect_bd_intf_net [get_bd_intf_pins axis_monitor] [get_bd_intf_pins packet_sizer/axis]
connect_bd_intf_net [get_bd_intf_pins axis_in] [get_bd_intf_pins packetizer/axis_in]
connect_bd_intf_net [get_bd_intf_pins axis_out] [get_bd_intf_pins packetizer/axis_out]
connect_bd_net [get_bd_pins packet_sizer/packet_cycles] [get_bd_pins packetizer/packet_cycles]
connect_bd_net -net pcie_bridge_axi_aclk [get_bd_pins clk] [get_bd_pins packetizer/clk] [get_bd_pins packet_sizer/clk]
connect_bd_net -net pcie_bridge_axi_aresetn [get_bd_pins resetn] [get_bd_pins packetizer/resetn] [get_bd_pins packet_sizer/resetn]

current_bd_instance /system_interconnect
connect_bd_intf_net [get_bd_intf_pins S00_AXI] [get_bd_intf_pins system_interconnect/S00_AXI]
connect_bd_intf_net [get_bd_intf_pins axi_revision/S_AXI] [get_bd_intf_pins system_interconnect/M00_AXI]
connect_bd_intf_net [get_bd_intf_pins M01_AXI] [get_bd_intf_pins system_interconnect/M01_AXI]
connect_bd_net -net pcie_bridge_axi_aclk [get_bd_pins aclk] [get_bd_pins system_interconnect/aclk] [get_bd_pins axi_revision/AXI_ACLK]
connect_bd_net -net pcie_bridge_axi_aresetn [get_bd_pins aresetn] [get_bd_pins system_interconnect/aresetn] [get_bd_pins axi_revision/AXI_ARESETN]

current_bd_instance /host_ram_to_rdmx
connect_bd_intf_net [get_bd_intf_pins rdmx_xmit/S_AXI] [get_bd_intf_pins dma_pci_to_rdmx/DST_AXI]
connect_bd_intf_net [get_bd_intf_pins SRC_AXI] [get_bd_intf_pins dma_pci_to_rdmx/SRC_AXI]
connect_bd_intf_net [get_bd_intf_pins AXIS_TX] [get_bd_intf_pins rdmx_xmit/AXIS_TX]
connect_bd_net -net control_resetn_out1 [get_bd_pins src_resetn] [get_bd_pins dma_pci_to_rdmx/resetn] [get_bd_pins rdmx_xmit/src_resetn]
connect_bd_net [get_bd_pins dma_pci_to_rdmx/idle] [get_bd_pins idle]
connect_bd_net -net pcie_bridge_axi_aclk [get_bd_pins clk] \
  [get_bd_pins dma_pci_to_rdmx/clk] [get_bd_pins rdmx_xmit/src_clk] [get_bd_pins rdmx_xmit/dst_clk]
connect_bd_net [get_bd_pins src_address] [get_bd_pins dma_pci_to_rdmx/src_address]
connect_bd_net [get_bd_pins start] [get_bd_pins dma_pci_to_rdmx/start]

current_bd_instance /
connect_bd_intf_net [get_bd_intf_pins pcie_bridge/AXIS_RDMX] [get_bd_intf_pins packet_buffer/axis_pcie_out]
connect_bd_intf_net [get_bd_intf_pins pcie_bridge/AXIS_RDMX] [get_bd_intf_pins control/seq_axis]
connect_bd_intf_net [get_bd_intf_ports pcie_refclk] [get_bd_intf_pins pcie_bridge/pcie_refclk]
connect_bd_intf_net [get_bd_intf_pins packet_buffer/axis_in] [get_bd_intf_pins qsfp/axis_rx]
connect_bd_intf_net [get_bd_intf_ports ddr4_bank0_clk] [get_bd_intf_pins packet_buffer/ddr4_clk_0]
connect_bd_intf_net [get_bd_intf_ports ddr4_bank1_clk] [get_bd_intf_pins packet_buffer/ddr4_clk_1]
connect_bd_intf_net [get_bd_intf_pins host_ram_to_rdmx/SRC_AXI] [get_bd_intf_pins pcie_bridge/S_AXI_ABM]
connect_bd_intf_net [get_bd_intf_ports qsfp0_clk] [get_bd_intf_pins qsfp/gt_ref_clk]
connect_bd_intf_net [get_bd_intf_pins packet_buffer/axis_qsfp_out] [get_bd_intf_pins qsfp/axis_loopback]
connect_bd_intf_net [get_bd_intf_ports m0_ddr4] [get_bd_intf_pins packet_buffer/ddr4_0]
connect_bd_intf_net [get_bd_intf_ports m1_ddr4] [get_bd_intf_pins packet_buffer/ddr4_1]
connect_bd_intf_net [get_bd_intf_pins pcie_bridge/M_AXI_B] [get_bd_intf_pins system_interconnect/S00_AXI]
connect_bd_intf_net [get_bd_intf_ports pcie_mgt] [get_bd_intf_pins pcie_bridge/pcie_mgt]
connect_bd_intf_net [get_bd_intf_ports qsfp0_gt] [get_bd_intf_pins qsfp/gt_serial_port]
connect_bd_intf_net [get_bd_intf_pins host_ram_to_rdmx/AXIS_TX] [get_bd_intf_pins qsfp/axis_xmit]
connect_bd_intf_net [get_bd_intf_pins system_interconnect/M01_AXI] [get_bd_intf_pins control/S_AXI]
connect_bd_net -net abm_sender_idle [get_bd_pins host_ram_to_rdmx/idle] [get_bd_pins control/xmit_idle]
connect_bd_net [get_bd_pins control/gen_packets] [get_bd_pins qsfp/gen_packets]
connect_bd_net [get_bd_pins control/loopback] [get_bd_pins packet_buffer/loopback_mode] [get_bd_pins qsfp/loopback_mode]
connect_bd_net [get_bd_pins control/packet_count] [get_bd_pins qsfp/max_packets]
connect_bd_net [get_bd_pins control/resetn_out] \
  [get_bd_pins packet_buffer/resetn] [get_bd_pins qsfp/resetn] [get_bd_pins pcie_bridge/resetn_in] \
  [get_bd_pins host_ram_to_rdmx/src_resetn]
connect_bd_net -net init_clk_0_1 [get_bd_ports init_clk] [get_bd_pins qsfp/init_clk]
connect_bd_net [get_bd_pins packet_buffer/bad_packet_strb] [get_bd_pins control/bad_packet_strb]
connect_bd_net [get_bd_pins packet_buffer/ddr_calib_complete_0] [get_bd_pins control/async_ddr_cal_0]
connect_bd_net [get_bd_pins packet_buffer/ddr_calib_complete_1] [get_bd_pins control/async_ddr_cal_1]
connect_bd_net [get_bd_pins packet_buffer/good_packet_strb] [get_bd_pins control/good_packet_strb]
connect_bd_net [get_bd_pins packet_buffer/hwm_0] [get_bd_pins control/hwm_0]
connect_bd_net [get_bd_pins packet_buffer/hwm_1] [get_bd_pins control/hwm_1]
connect_bd_net [get_bd_pins packet_buffer/overflow_0] [get_bd_pins control/overflow_0]
connect_bd_net [get_bd_pins packet_buffer/overflow_1] [get_bd_pins control/overflow_1]
connect_bd_net -net pause_pci_1 [get_bd_pins control/pause_pci] [get_bd_pins pcie_bridge/pause_pci]
connect_bd_net -net pci_base_1 [get_bd_pins control/pci_base] [get_bd_pins pcie_bridge/pci_base]
connect_bd_net -net pci_size_1 [get_bd_pins control/pci_size] [get_bd_pins pcie_bridge/pci_size]
connect_bd_net [get_bd_pins pcie_bridge/axi_aclk] \
  [get_bd_pins packet_buffer/clk] [get_bd_pins qsfp/clk] [get_bd_pins system_interconnect/aclk] \
  [get_bd_pins host_ram_to_rdmx/clk] [get_bd_pins control/clk]
connect_bd_net [get_bd_pins pcie_bridge/axi_aresetn] [get_bd_pins system_interconnect/aresetn] [get_bd_pins control/resetn]
connect_bd_net [get_bd_pins pcie_bridge/pci_range_err_strb] [get_bd_pins control/pci_range_err_strb]
connect_bd_net [get_bd_pins qsfp/gen_idle] [get_bd_pins control/generator_idle]
connect_bd_net [get_bd_pins qsfp/led_green_l] [get_bd_ports led_green_l]
connect_bd_net [get_bd_pins qsfp/led_orange_l] [get_bd_ports led_orange_l]
connect_bd_net [get_bd_pins qsfp/qsfp_lp] [get_bd_ports qsfp_lp]
connect_bd_net [get_bd_pins qsfp/qsfp_rst_l] [get_bd_ports qsfp_rst_l]
connect_bd_net [get_bd_pins qsfp/rx_aligned] [get_bd_pins control/async_pcs_aligned]
connect_bd_net -net src_address_1 [get_bd_pins control/xmit_src_addr] [get_bd_pins host_ram_to_rdmx/src_address]
connect_bd_net -net start_1 [get_bd_pins control/xmit_start] [get_bd_pins host_ram_to_rdmx/start]

# ---- address map ----
assign_bd_address -offset 0x0000000000000000 -range 16E -target_address_space [get_bd_addr_spaces host_ram_to_rdmx/dma_pci_to_rdmx/DST_AXI] [get_bd_addr_segs host_ram_to_rdmx/rdmx_xmit/S_AXI/reg0]
assign_bd_address -offset 0x0000000000000000 -range 16E -target_address_space [get_bd_addr_spaces host_ram_to_rdmx/dma_pci_to_rdmx/SRC_AXI] [get_bd_addr_segs pcie_bridge/pcie_bridge/S_AXI_B/BAR0]
assign_bd_address -offset 0x0000000100000000 -range 4G -target_address_space [get_bd_addr_spaces packet_buffer/channel_0/ram_reader/M_AXI] [get_bd_addr_segs packet_buffer/channel_0/ddr/ddr4/C0_DDR4_MEMORY_MAP/C0_DDR4_ADDRESS_BLOCK]
assign_bd_address -offset 0x0000000100000000 -range 4G -target_address_space [get_bd_addr_spaces packet_buffer/channel_0/stream_to_ram/M_AXI] [get_bd_addr_segs packet_buffer/channel_0/ddr/ddr4/C0_DDR4_MEMORY_MAP/C0_DDR4_ADDRESS_BLOCK]
assign_bd_address -offset 0x0000000200000000 -range 4G -target_address_space [get_bd_addr_spaces packet_buffer/channel_1/ram_reader/M_AXI] [get_bd_addr_segs packet_buffer/channel_1/ddr/ddr4/C0_DDR4_MEMORY_MAP/C0_DDR4_ADDRESS_BLOCK]
assign_bd_address -offset 0x0000000200000000 -range 4G -target_address_space [get_bd_addr_spaces packet_buffer/channel_1/stream_to_ram/M_AXI] [get_bd_addr_segs packet_buffer/channel_1/ddr/ddr4/C0_DDR4_MEMORY_MAP/C0_DDR4_ADDRESS_BLOCK]
assign_bd_address -offset 0x0000000000000000 -range 256 -target_address_space [get_bd_addr_spaces pcie_bridge/pcie_bridge/M_AXI_B] [get_bd_addr_segs system_interconnect/axi_revision/S_AXI/reg0]
assign_bd_address -offset 0x0000000000001000 -range 256 -target_address_space [get_bd_addr_spaces pcie_bridge/pcie_bridge/M_AXI_B] [get_bd_addr_segs control/S_AXI/reg0]
assign_bd_address -offset 0x0000000000000000 -range 16E -target_address_space [get_bd_addr_spaces pcie_bridge/rdmx_to_pci/M_AXI] [get_bd_addr_segs pcie_bridge/pcie_bridge/S_AXI_B/BAR0]

validate_bd_design
save_bd_design
